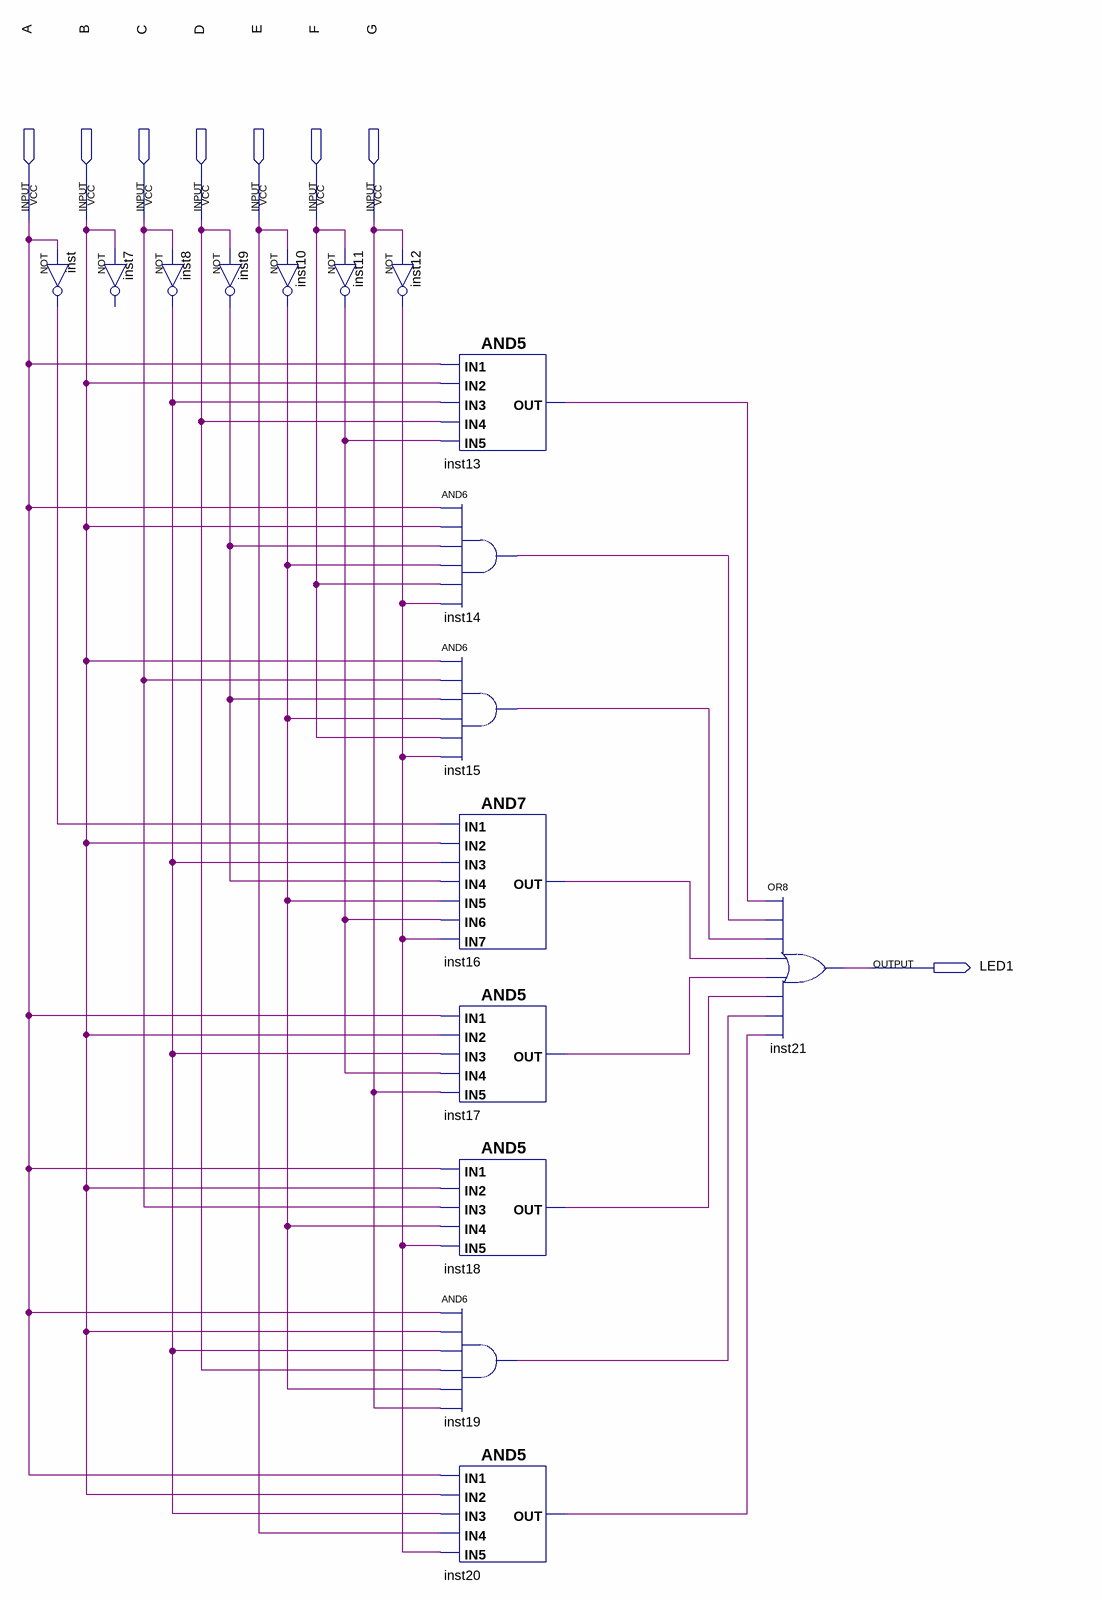
[diagram p0: schematic sheet]
// Quartus schematic LED1LINHA7MATRIZ.bdf as structural Verilog: 16 symbols, 8 pins
module LED1LINHA7MATRIZ (
  input  A,
  input  B,
  input  C,
  input  D,
  input  E,
  input  F,
  input  G,
  output LED1
);

  wire inst8_out, inst9_out, inst10_out, inst11_out, inst12_out, inst13_out, inst14_out, inst15_out,
       inst16_out, inst17_out, inst18_out, inst19_out, inst20_out, inst_out;

  not inst (inst_out, A);
  // NOT inst7 has open pins: IN=B, OUT=open
  not inst8 (inst8_out, C);
  not inst9 (inst9_out, D);
  not inst10 (inst10_out, E);
  not inst11 (inst11_out, F);
  not inst12 (inst12_out, G);
  and inst13 (inst13_out, A, B, inst8_out, D, inst11_out);
  and inst14 (inst14_out, A, B, inst9_out, inst10_out, F, inst12_out);
  and inst15 (inst15_out, B, C, inst9_out, inst10_out, F, inst12_out);
  and inst16 (inst16_out, inst_out, B, inst8_out, inst9_out, inst10_out, inst11_out, inst12_out);
  and inst17 (inst17_out, A, B, inst8_out, inst11_out, G);
  and inst18 (inst18_out, A, B, C, inst10_out, inst12_out);
  and inst19 (inst19_out, A, B, inst8_out, D, inst10_out, G);
  and inst20 (inst20_out, A, B, inst8_out, E, inst12_out);
  or inst21 (LED1, inst13_out, inst14_out, inst15_out, inst16_out, inst17_out, inst18_out, inst19_out, inst20_out);
endmodule
